# EAGLE board Word-Clock (EAGLE 7.3.0), part 1 of 2
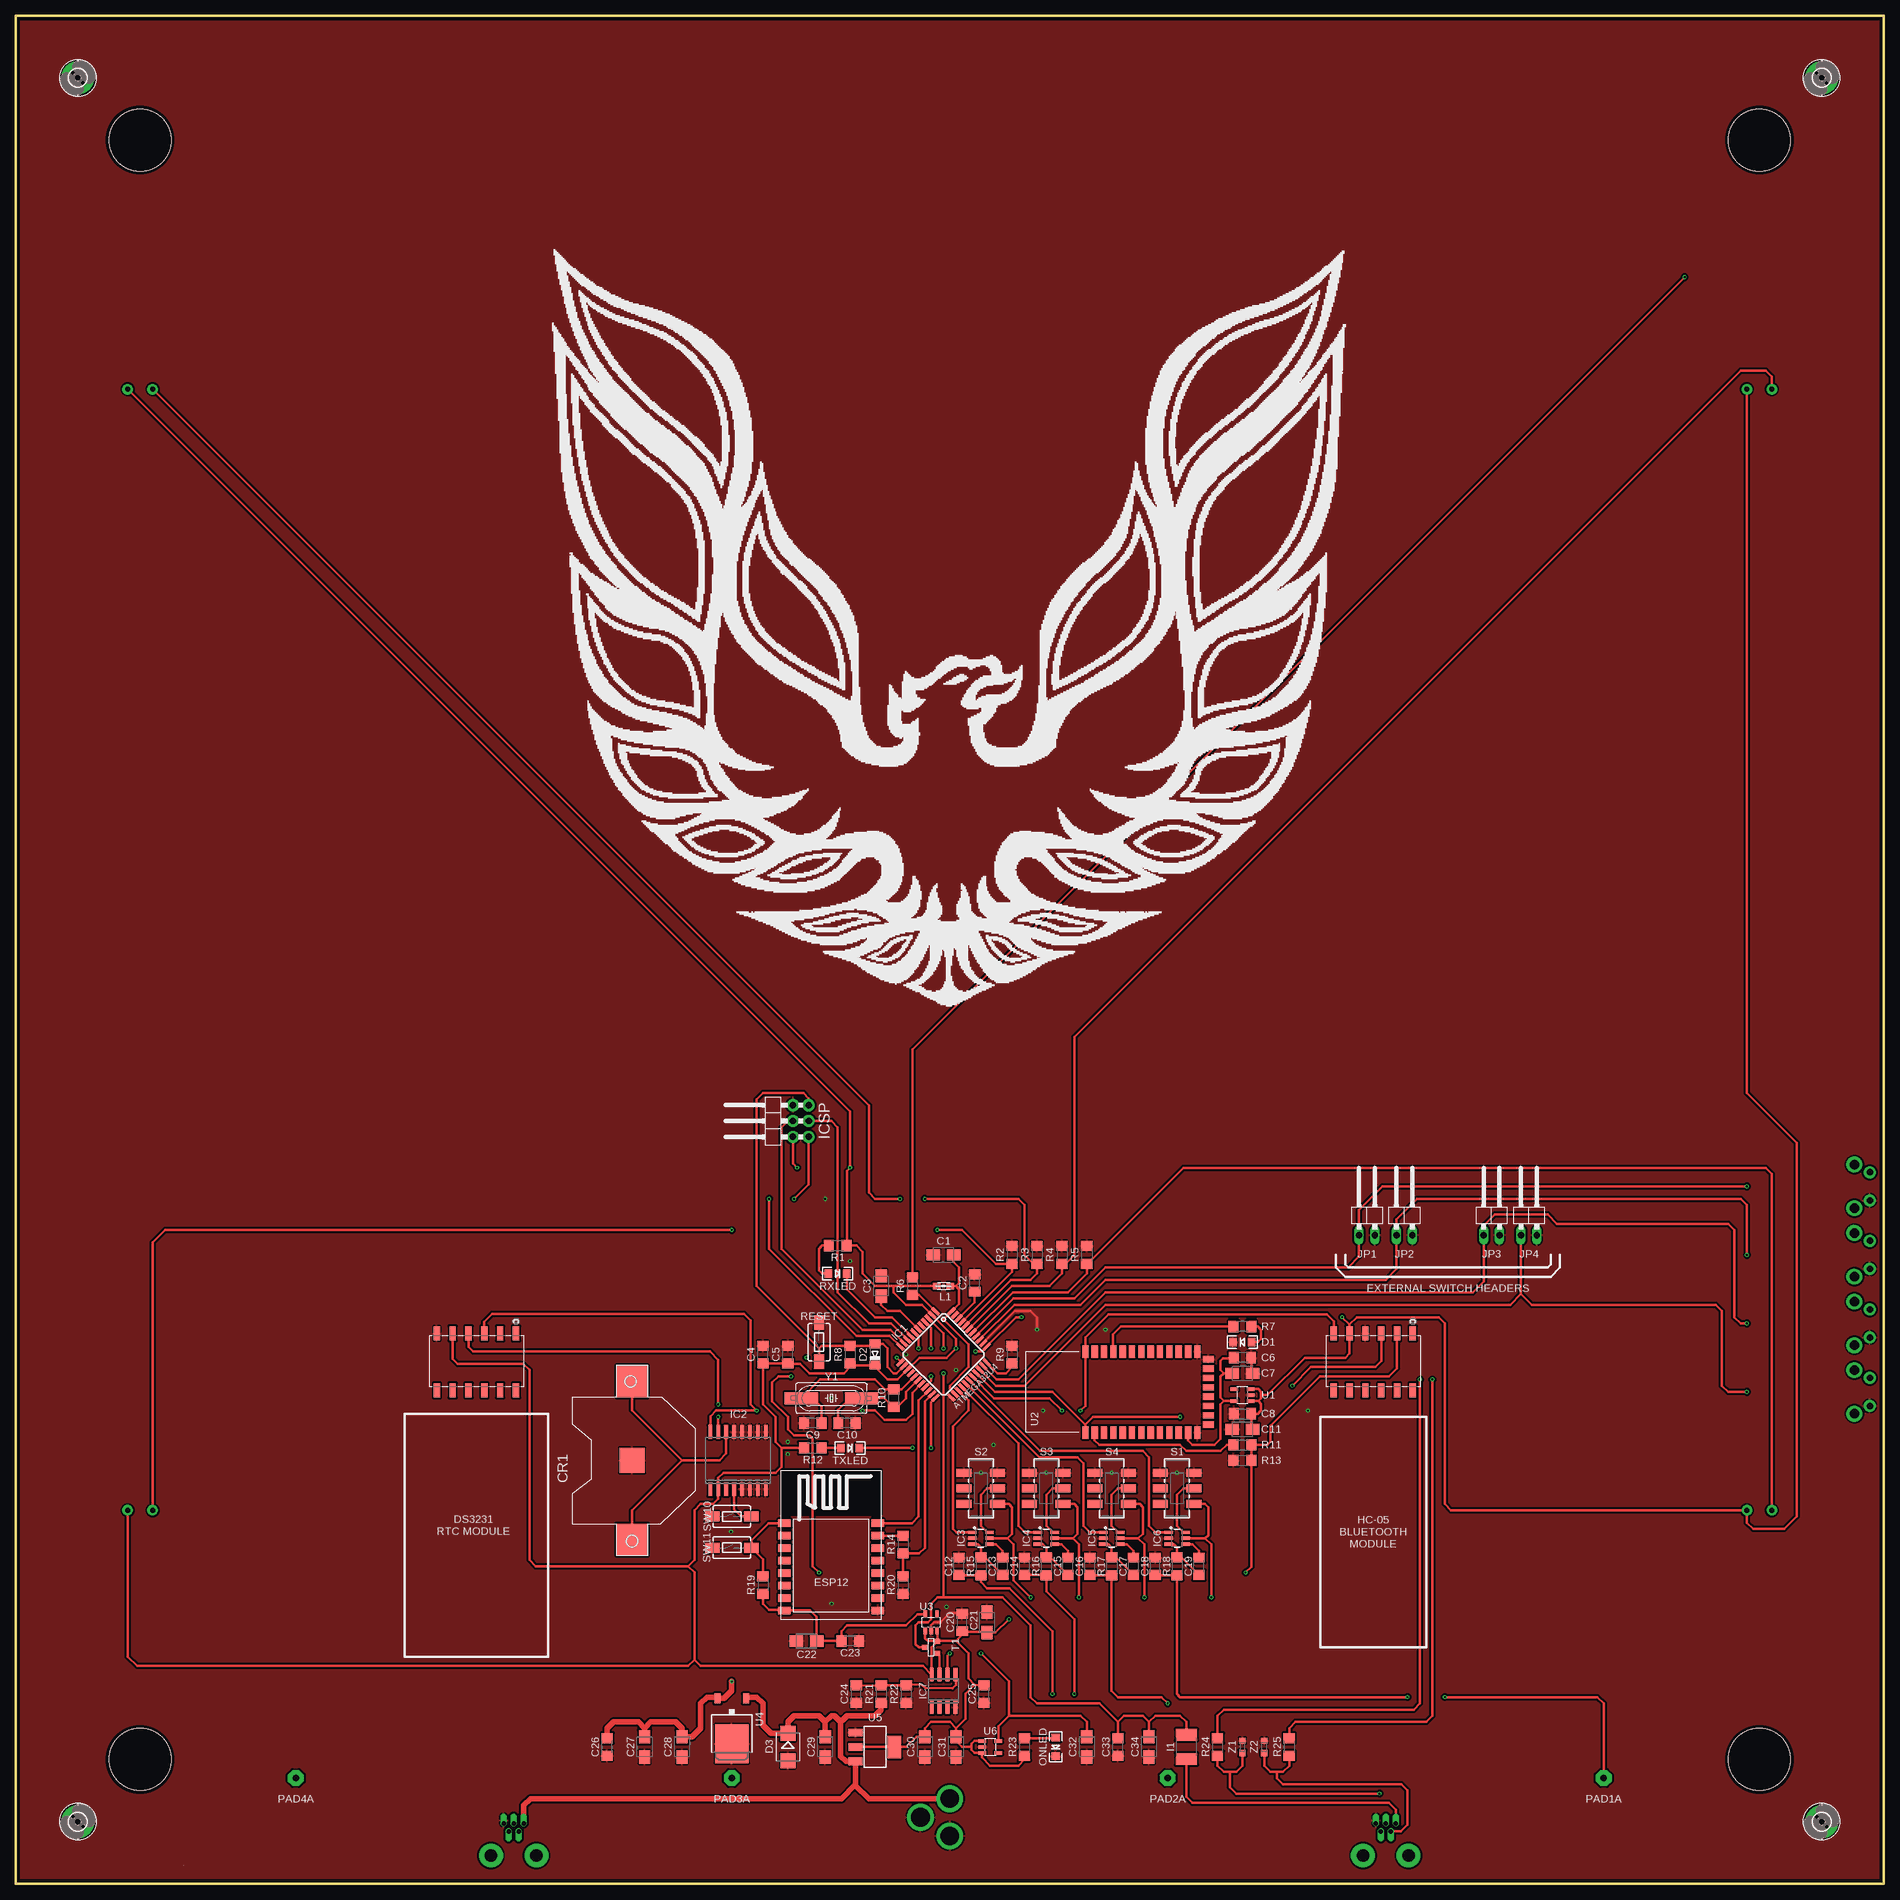
[diagram p4: board, top side]
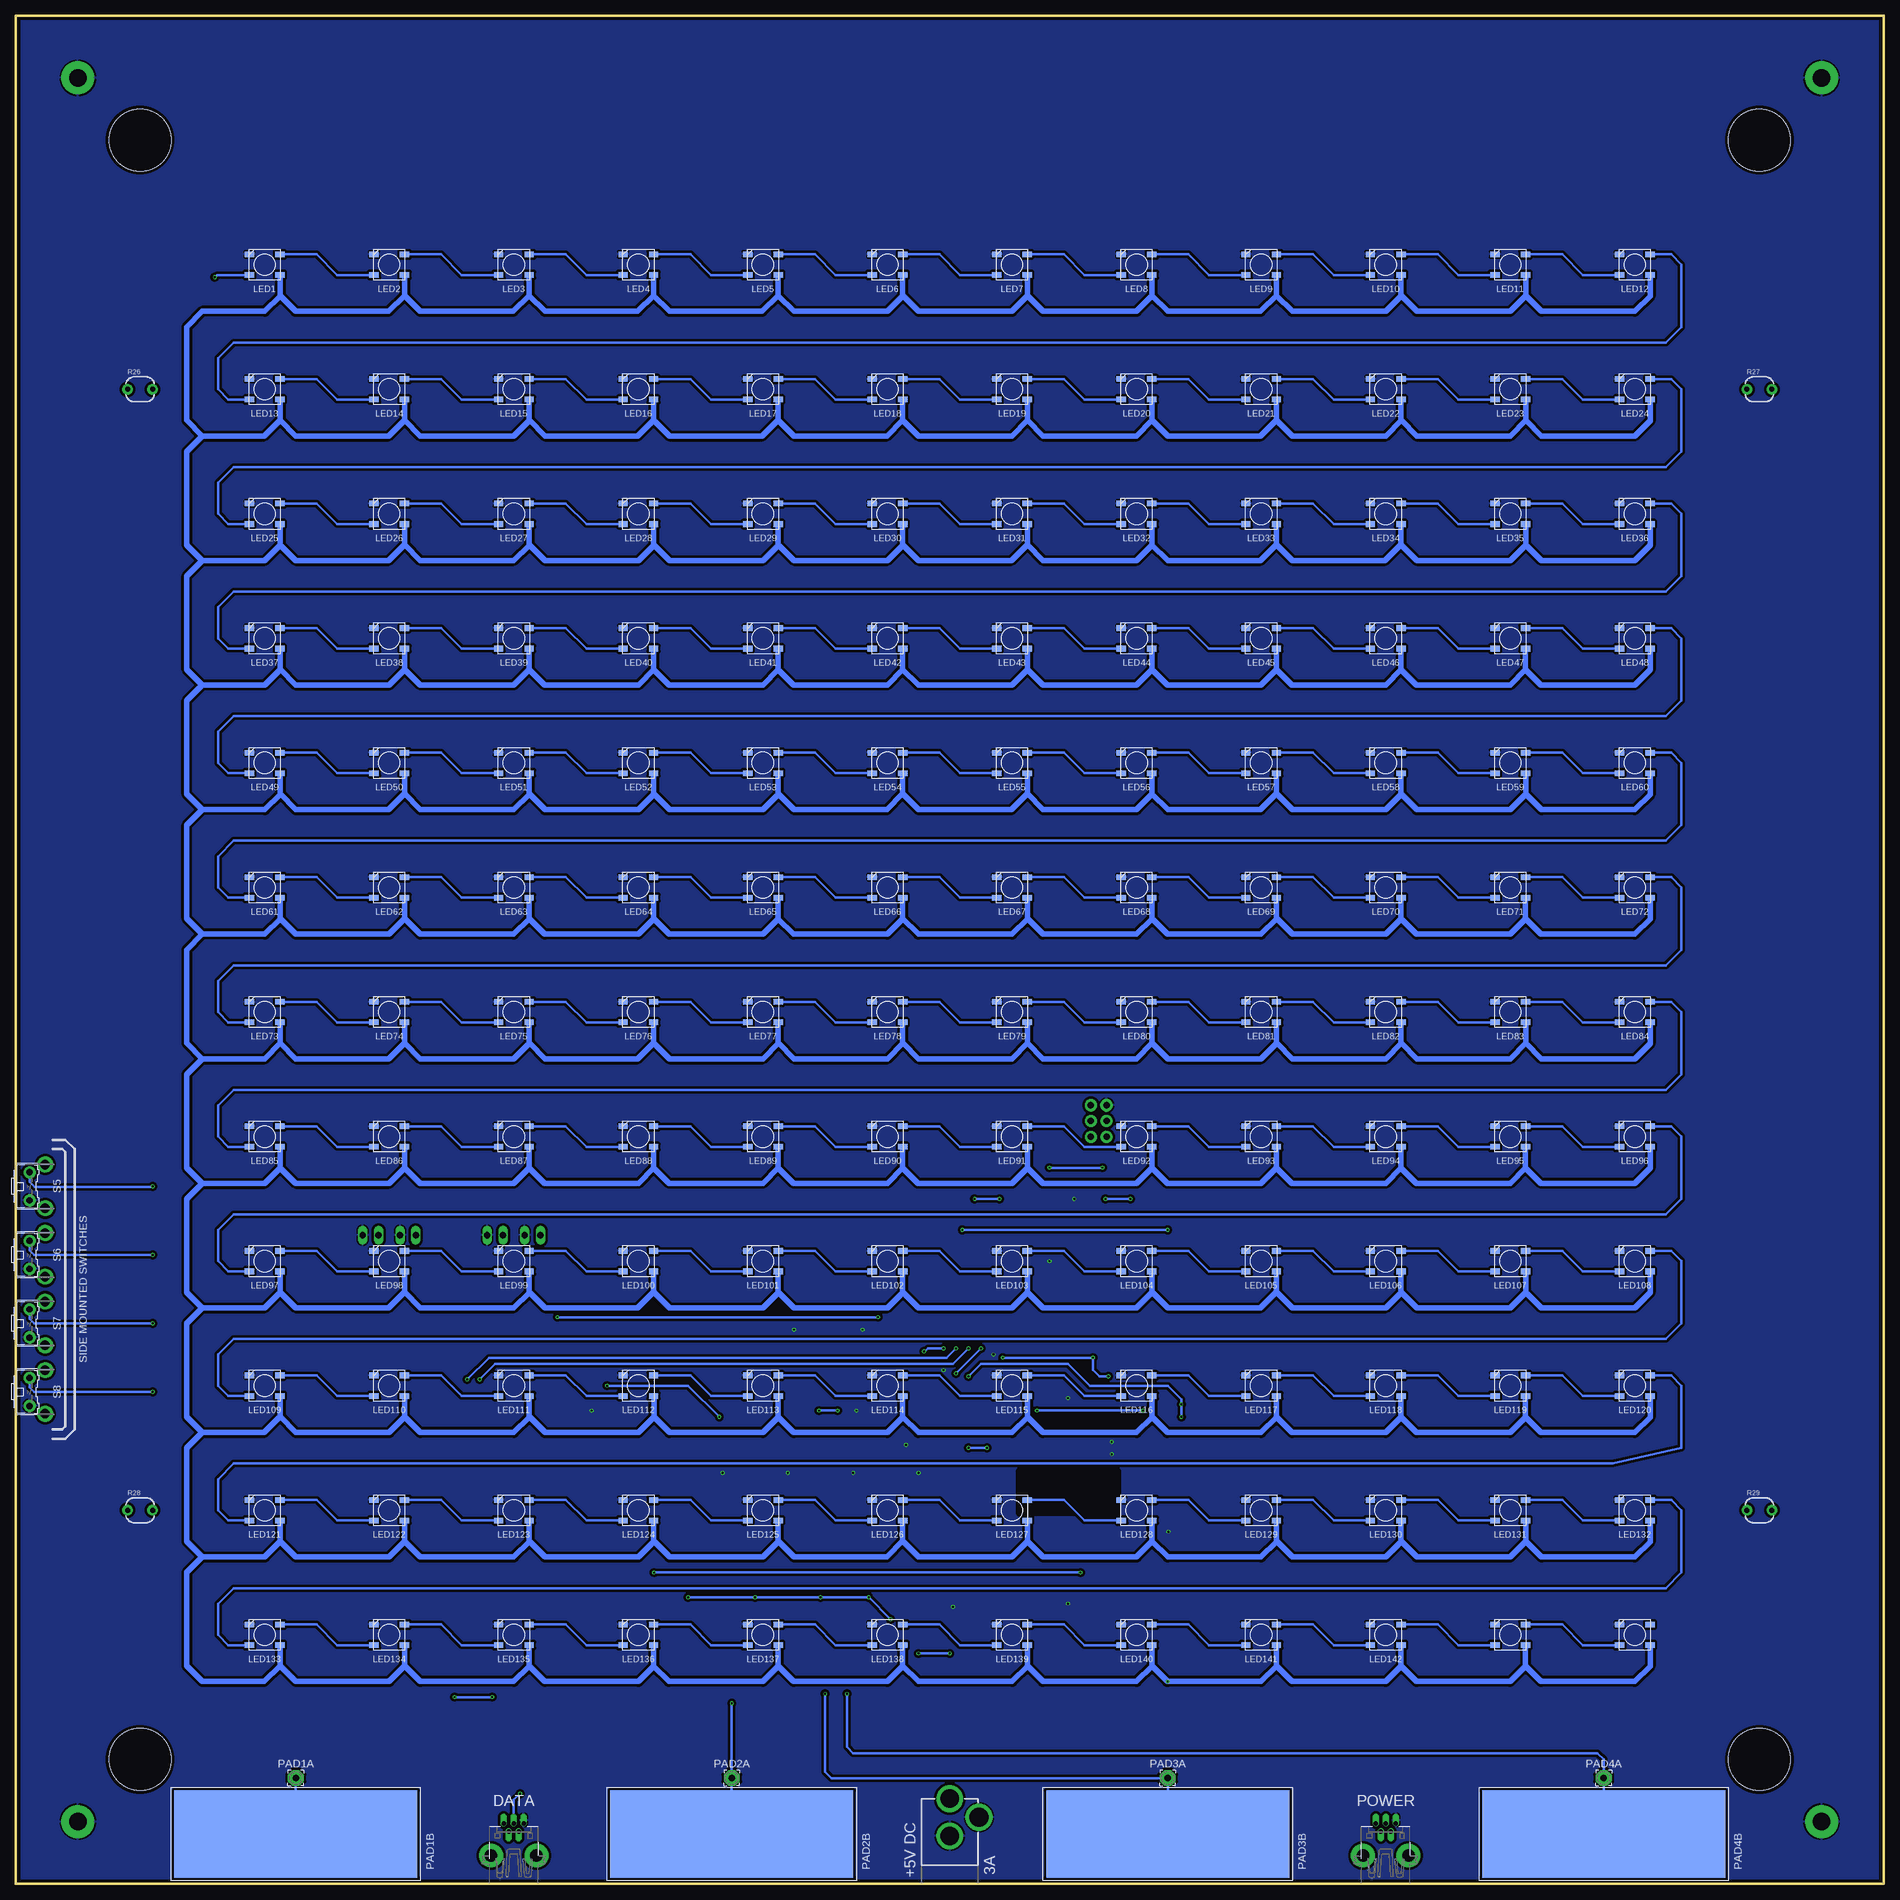
[diagram p5: board, bottom side, seen from below]

Size 300 x 300 mm. Coordinates in mm from the lower left corner, seen from the top.
Outline: 0,0 0,300 300,300 300,0 0,0
Copper layers (1*16): Top 0.035mm / dielectric 1.6mm / Bottom 0.035mm
Design rules "Elecrow_2-layer_PCB_eagle_rule": minimum track width 6mil, minimum drill 12mil, track to track 6mil, track to pad 6mil, pad to pad 6mil, via to via 8mil, smd to smd 0mil, copper to edge 20mil, drill to drill 10mil, minimum pad ring 6mil, minimum via ring 6mil, stop-mask expansion 0mil, vias tented up to drill 100mil, thermal gap 10mil
Net classes: 0 default: width 0.254 mm, drill 0.61 mm, clearance 0.254 mm; 1 power: width 0.254 mm, drill 0.61 mm, clearance 0.254 mm; 2 gnd: width 0.254 mm, drill 0.61 mm, clearance 0.254 mm; 3 usbvcc: width 0.254 mm, drill 0.61 mm, clearance 0.254 mm; 4 aref: width 0.254 mm, drill 0.61 mm, clearance 0.254 mm
Holes 10 mm at 20,280 280,280 20,20 280,20

## Footprints (pad centres in the part's own frame; a part is rotated, then mirrored left to right if it is on the bottom)
POWER_JACK_PTH = drill 2.997 pad 4.318: GND 0,7.7; GNDBREAK 4.7,10.7; PWR 0,13.7
SAMTEC_SSM-106-S-SH = smd 1.016 x 2.286: 1 0,0; 2 2.54,0; 3 5.08,0; 4 7.62,0; 5 10.16,0; 6 12.7,0; 8 12.7,9.144; 10 10.16,9.144; 12 7.62,9.144; 14 5.08,9.144; 16 2.54,9.144; 18 0,9.144
B/3528-21W = smd 2.15 x 1.8: + 1.625,0; - -1.625,0
C1206 = smd 1.6 x 1.8: 1 -1.4,0; 2 1.4,0
CR2032-SMD = smd 5.08 x 5.08: +$1 -12.7,0; +$2 12.7,0 | smd 4.064 x 4.064: - 0,0
LED-1206 = smd 1.2 x 1.4: A -1.5,0; C 1.5,0
MINIMELF = smd 1.4 x 1.8: A 1.7,0; C -1.7,0
SMB = smd 2.4 x 2.4: A 2.2,0; C -2.2,0
USB-MINIB-THM-MOLEX = drill 0.7 offset: D+ 0,9.72; D- -0.8,8.42; GND 1.6,9.72; ID 0.8,8.42; VBUS -1.6,9.72 | drill 2 pad 3.81: GND1 -3.65,4.57; GND4 3.65,4.57
ESP-12 = smd 2 x 1.2: 1 -7.5,4.5; 2 -7.5,2.5; 3 -7.5,0.5; 4 -7.5,-1.5; 5 -7.5,-3.5; 6 -7.5,-5.5; 7 -7.5,-7.5; 8 -7.5,-9.5; 9 7.5,-9.5; 10 7.5,-7.5; 11 7.5,-5.5; 12 7.5,-3.5; 13 7.5,-1.5; 14 7.5,0.5; 15 7.5,2.5; 16 7.5,4.5
2,8-PAD = drill 2.8 pad 5.334: B2,8 0,0
L1812 = smd 1.9 x 3.4: 1 -1.95,0; 2 1.95,0
TQFP44 = smd 1.5 x 0.5: 1 -5.8,4; 2 -5.8,3.2; 3 -5.8,2.4; 4 -5.8,1.6; 5 -5.8,0.8; 6 -5.8,0; 7 -5.8,-0.8; 8 -5.8,-1.6; 9 -5.8,-2.4; 10 -5.8,-3.2; 11 -5.8,-4; 23 5.8,-4; 24 5.8,-3.2; 25 5.8,-2.4; 26 5.8,-1.6; 27 5.8,-0.8; 28 5.8,0; 29 5.8,0.8; 30 5.8,1.6; 31 5.8,2.4; 32 5.8,3.2; 33 5.8,4 | smd 0.5 x 1.5: 12 -4,-5.8; 13 -3.2,-5.8; 14 -2.4,-5.8; 15 -1.6,-5.8; 16 -0.8,-5.8; 17 0,-5.8; 18 0.8,-5.8; 19 1.6,-5.8; 20 2.4,-5.8; 21 3.2,-5.8; 22 4,-5.8; 34 4,5.8; 35 3.2,5.8; 36 2.4,5.8; 37 1.6,5.8; 38 0.8,5.8; 39 0,5.8; 40 -0.8,5.8; 41 -1.6,5.8; 42 -2.4,5.8; 43 -3.2,5.8; 44 -4,5.8
SO16W = smd 0.6 x 2.2: 1 -4.445,-4.6; 2 -3.175,-4.6; 3 -1.905,-4.6; 4 -0.635,-4.6; 5 0.635,-4.6; 6 1.905,-4.6; 7 3.175,-4.6; 8 4.445,-4.6; 9 4.445,4.6; 10 3.175,4.6; 11 1.905,4.6; 12 0.635,4.6; 13 -0.635,4.6; 14 -1.905,4.6; 15 -3.175,4.6; 16 -4.445,4.6
SOT23-6 = smd 0.55 x 1.35: 1 -0.95,-1.375; 2 0,-1.375; 3 0.95,-1.375; 4 0.95,1.375; 5 0,1.375; 6 -0.95,1.375
SO08 = smd 0.6 x 2.2: 1 -1.905,-2.6; 2 -0.635,-2.6; 3 0.635,-2.6; 4 1.905,-2.6; 5 1.905,2.6; 6 0.635,2.6; 7 -0.635,2.6; 8 -1.905,2.6
2X03/90 = drill 1.016 pad 1.93: 1 -2.54,-6.35; 2 -2.54,-3.81; 3 0,-6.35; 4 0,-3.81; 5 2.54,-6.35; 6 2.54,-3.81
1X02/90 = drill 1.016 long: 1 -1.27,-3.81; 2 1.27,-3.81
0805 = smd 1.2 x 1: 1 -1.1,0; 2 1.1,0
WS2812B = smd 1.5 x 0.9: 1-VDD 2.45,-1.65; 2-DOUT 2.45,1.65; 3-GND -2.45,1.65; 4-DIN -2.45,-1.65
2,54/1,0 = drill 1.016 pad 2.54 octagon: 1 0,0
CAPSENSE_PAD = smd 39 x 14: P$1 0,0
R1206 = smd 1.6 x 1.803: 1 -1.422,0; 2 1.422,0
PHOTOCELL = drill 0.8 pad 1.676: 1 -2,0; 2 2,0
TACTILE-SWITCH-1101NE = smd 2.3 x 1.6: 1 -3.15,0; 2 3.15,0
JS202011SCQN = smd 1.27 x 2.4: 1 -2.5,-2.7; 2 0,-2.7; 3 2.5,-2.7; 4 -2.5,2.7; 5 0,2.7; 6 2.5,2.7
B3F-31XX = drill 1.016 pad 1.93: 1 -2.261,-1.245; 2 2.261,-1.245 | drill 1.499 pad 2.54: 3 -3.505,1.245; 4 3.505,1.245
SOT-23 = smd 0.787 x 0.889: 1 0.025,-1.016; 2 -0.94,1.016; 3 0.991,1.016
SOT23-DBV = smd 0.55 x 1.2: 1 -0.95,-1.3; 2 0,-1.3; 3 0.95,-1.3; 4 0.95,1.3; 5 -0.95,1.3
BLUETOOTH_SMD = smd 2 x 1: 1 0,0; 2 0,-1.5; 3 0,-3; 4 0,-4.5; 5 0,-6; 6 0,-7.5; 7 0,-9; 8 0,-10.5; 9 0,-12; 10 0,-13.5; 11 0,-15; 12 0,-16.5; 13 0,-18; 22 13,-18; 23 13,-16.5; 24 13,-15; 25 13,-13.5; 26 13,-12; 27 13,-10.5; 28 13,-9; 29 13,-7.5; 30 13,-6; 31 13,-4.5; 32 13,-3; 33 13,-1.5; 34 13,0 | smd 1 x 1.8: 14 1.25,-19.75; 15 2.75,-19.75; 16 4.25,-19.75; 17 5.75,-19.75; 18 7.25,-19.75; 19 8.75,-19.75; 20 10.25,-19.75; 21 11.75,-19.75
TO-252 = smd 1 x 1.6: 1 -2.28,-4.8; 2 2.28,-4.8 | smd 5.4 x 6.2: 3 0,2.5
SOT223 = smd 1.219 x 2.235: 1 -2.311,-3.099; 2 0,-3.099; 3 2.311,-3.099 | smd 3.6 x 2.2: 4 0,3.099
HC49UP = smd 5.334 x 1.93: 1 -4.826,0; 2 4.826,0
CT/CN0603 = smd 1 x 1: 1 -1,0; 2 1,0

## Placement (x,y rotation side)
+5VDC  POWER_JACKPTH  [POWER_JACK_PTH]  150,0 0 bottom
BLUETOOTH  SSM-106-S-SH  [SAMTEC_SSM-106-S-SH]  224.35,88.4 180 top
C1  1uF  [B/3528-21W]  149,101 0 top
C2  100n  [C1206]  154,96.5 90 top
C3  1uF  [B/3528-21W]  139,96 270 top
C4  100n  [C1206]  120,85 90 top
C5  100n  [C1206]  124,85 90 top
C6  100n  [C1206]  197,84.5 180 top
C7  1u  [B/3528-21W]  197,82 180 top
C8  100n  [C1206]  197,75.5 0 top
C9  22p  [C1206]  128,74 180 top
C10  22p  [C1206]  133.5,74 180 top
C11  1u  [B/3528-21W]  197,73 0 top
C12  100n  [C1206]  151.5,51 90 top
C13  100n  [C1206]  158.5,51 90 top
C14  100n  [C1206]  162,51 90 top
C15  100n  [C1206]  169,51 90 top
C16  100n  [C1206]  172.5,51 90 top
C17  100n  [C1206]  179.5,51 90 top
C18  100n  [C1206]  183,51 90 top
C19  100n  [C1206]  190,51 90 top
C20  100n  [C1206]  152,42 90 top
C21  1u  [B/3528-21W]  156,42 270 top
C22  1u  [B/3528-21W]  127,39 0 top
C23  100n  [C1206]  134,39 180 top
C24  100n  [C1206]  135,30.5 90 top
C25  100n  [C1206]  155.5,30.5 90 top
C26  100n  [C1206]  95,22 90 top
C27  10u  [B/3528-21W]  101,22 90 top
C28  10u  [B/3528-21W]  107,22 90 top
C29  10u  [B/3528-21W]  130,22 90 top
C30  10u  [B/3528-21W]  146,22 90 top
C31  1u  [B/3528-21W]  151,22 90 top
C32  1u  [B/3528-21W]  172,22 90 top
C33  100n  [C1206]  177,22 90 top
C34  10u  [B/3528-21W]  182,22 90 top
CR1  CR2032  [CR2032-SMD]  99,68 90 top
D1  BLUE  [LED-1206]  197,87 180 top
D2  CD1206-S01575  [MINIMELF]  138,85 90 top
D3  M7  [SMB]  124,22 270 top
DATA  USBDATA  [USB-MINIB-THM-MOLEX]  220,0 0 bottom
DS3231  SSM-106-S-SH  [SAMTEC_SSM-106-S-SH]  80.35,88.4 180 top
ESP12  ESP12  [ESP-12]  130.94,53.41 0 top
H1  [2,8-PAD]  10,10 0 top
H2  [2,8-PAD]  10,290 0 top
H3  [2,8-PAD]  290,290 0 top
H4  [2,8-PAD]  290,10 0 top
I1  MF-MSMF050-2 500mA  [L1812]  188,22 90 top
IC1  ATMEGA32U4TQFP-44  [TQFP44]  149,85 315 top
IC2  DS3231/SO  [SO16W]  116,68 0 top
IC3  AT42QT1010SOT23  [SOT23-6]  155,55.5 270 top
IC4  AT42QT1010SOT23  [SOT23-6]  165.5,55.5 270 top
IC5  AT42QT1010SOT23  [SOT23-6]  176,55.5 270 top
IC6  AT42QT1010SOT23  [SOT23-6]  186.5,55.5 270 top
IC7  LMV358IDGKR  [SO08]  149,31 0 top
ICSP  ICSP  [2X03/90]  121,122.5 90 top
JP1  [1X02/90]  217,108 0 top
JP2  [1X02/90]  223,108 0 top
JP3  [1X02/90]  237,108 0 top
JP4  [1X02/90]  243,108 0 top
L1  MH2029-300Y  [0805]  149,96 0 top
LED1  WS2812B  [WS2812B]  260,260 0 bottom
LED2  WS2812B  [WS2812B]  240,260 0 bottom
LED3  WS2812B  [WS2812B]  220,260 0 bottom
LED4  WS2812B  [WS2812B]  200,260 0 bottom
LED5  WS2812B  [WS2812B]  180,260 0 bottom
LED6  WS2812B  [WS2812B]  160,260 0 bottom
LED7  WS2812B  [WS2812B]  140,260 0 bottom
LED8  WS2812B  [WS2812B]  120,260 0 bottom
LED9  WS2812B  [WS2812B]  100,260 0 bottom
LED10  WS2812B  [WS2812B]  80,260 0 bottom
LED11  WS2812B  [WS2812B]  60,260 0 bottom
LED12  WS2812B  [WS2812B]  40,260 0 bottom
LED13  WS2812B  [WS2812B]  260,240 0 bottom
LED14  WS2812B  [WS2812B]  240,240 0 bottom
LED15  WS2812B  [WS2812B]  220,240 0 bottom
LED16  WS2812B  [WS2812B]  200,240 0 bottom
LED17  WS2812B  [WS2812B]  180,240 0 bottom
LED18  WS2812B  [WS2812B]  160,240 0 bottom
LED19  WS2812B  [WS2812B]  140,240 0 bottom
LED20  WS2812B  [WS2812B]  120,240 0 bottom
LED21  WS2812B  [WS2812B]  100,240 0 bottom
LED22  WS2812B  [WS2812B]  80,240 0 bottom
LED23  WS2812B  [WS2812B]  60,240 0 bottom
LED24  WS2812B  [WS2812B]  40,240 0 bottom
LED25  WS2812B  [WS2812B]  260,220 0 bottom
LED26  WS2812B  [WS2812B]  240,220 0 bottom
LED27  WS2812B  [WS2812B]  220,220 0 bottom
LED28  WS2812B  [WS2812B]  200,220 0 bottom
LED29  WS2812B  [WS2812B]  180,220 0 bottom
LED30  WS2812B  [WS2812B]  160,220 0 bottom
LED31  WS2812B  [WS2812B]  140,220 0 bottom
LED32  WS2812B  [WS2812B]  120,220 0 bottom
LED33  WS2812B  [WS2812B]  100,220 0 bottom
LED34  WS2812B  [WS2812B]  80,220 0 bottom
LED35  WS2812B  [WS2812B]  60,220 0 bottom
LED36  WS2812B  [WS2812B]  40,220 0 bottom
LED37  WS2812B  [WS2812B]  260,200 0 bottom
LED38  WS2812B  [WS2812B]  240,200 0 bottom
LED39  WS2812B  [WS2812B]  220,200 0 bottom
LED40  WS2812B  [WS2812B]  200,200 0 bottom
LED41  WS2812B  [WS2812B]  180,200 0 bottom
LED42  WS2812B  [WS2812B]  160,200 0 bottom
LED43  WS2812B  [WS2812B]  140,200 0 bottom
LED44  WS2812B  [WS2812B]  120,200 0 bottom
LED45  WS2812B  [WS2812B]  100,200 0 bottom
LED46  WS2812B  [WS2812B]  80,200 0 bottom
LED47  WS2812B  [WS2812B]  60,200 0 bottom
LED48  WS2812B  [WS2812B]  40,200 0 bottom
LED49  WS2812B  [WS2812B]  260,180 0 bottom
LED50  WS2812B  [WS2812B]  240,180 0 bottom
LED51  WS2812B  [WS2812B]  220,180 0 bottom
LED52  WS2812B  [WS2812B]  200,180 0 bottom
LED53  WS2812B  [WS2812B]  180,180 0 bottom
LED54  WS2812B  [WS2812B]  160,180 0 bottom
LED55  WS2812B  [WS2812B]  140,180 0 bottom
LED56  WS2812B  [WS2812B]  120,180 0 bottom
LED57  WS2812B  [WS2812B]  100,180 0 bottom
LED58  WS2812B  [WS2812B]  80,180 0 bottom
LED59  WS2812B  [WS2812B]  60,180 0 bottom
LED60  WS2812B  [WS2812B]  40,180 0 bottom
LED61  WS2812B  [WS2812B]  260,160 0 bottom
LED62  WS2812B  [WS2812B]  240,160 0 bottom
LED63  WS2812B  [WS2812B]  220,160 0 bottom
LED64  WS2812B  [WS2812B]  200,160 0 bottom
LED65  WS2812B  [WS2812B]  180,160 0 bottom
LED66  WS2812B  [WS2812B]  160,160 0 bottom
LED67  WS2812B  [WS2812B]  140,160 0 bottom
LED68  WS2812B  [WS2812B]  120,160 0 bottom
LED69  WS2812B  [WS2812B]  100,160 0 bottom
LED70  WS2812B  [WS2812B]  80,160 0 bottom
LED71  WS2812B  [WS2812B]  60,160 0 bottom
LED72  WS2812B  [WS2812B]  40,160 0 bottom
LED73  WS2812B  [WS2812B]  260,140 0 bottom
LED74  WS2812B  [WS2812B]  240,140 0 bottom
LED75  WS2812B  [WS2812B]  220,140 0 bottom
LED76  WS2812B  [WS2812B]  200,140 0 bottom
LED77  WS2812B  [WS2812B]  180,140 0 bottom
LED78  WS2812B  [WS2812B]  160,140 0 bottom
LED79  WS2812B  [WS2812B]  140,140 0 bottom
LED80  WS2812B  [WS2812B]  120,140 0 bottom
LED81  WS2812B  [WS2812B]  100,140 0 bottom
LED82  WS2812B  [WS2812B]  80,140 0 bottom
LED83  WS2812B  [WS2812B]  60,140 0 bottom
LED84  WS2812B  [WS2812B]  40,140 0 bottom
LED85  WS2812B  [WS2812B]  260,120 0 bottom
LED86  WS2812B  [WS2812B]  240,120 0 bottom
LED87  WS2812B  [WS2812B]  220,120 0 bottom
LED88  WS2812B  [WS2812B]  200,120 0 bottom
LED89  WS2812B  [WS2812B]  180,120 0 bottom
LED90  WS2812B  [WS2812B]  160,120 0 bottom
LED91  WS2812B  [WS2812B]  140,120 0 bottom
LED92  WS2812B  [WS2812B]  120,120 0 bottom
LED93  WS2812B  [WS2812B]  100,120 0 bottom
LED94  WS2812B  [WS2812B]  80,120 0 bottom
LED95  WS2812B  [WS2812B]  60,120 0 bottom
LED96  WS2812B  [WS2812B]  40,120 0 bottom
LED97  WS2812B  [WS2812B]  260,100 0 bottom
LED98  WS2812B  [WS2812B]  240,100 0 bottom
LED99  WS2812B  [WS2812B]  220,100 0 bottom
LED100  WS2812B  [WS2812B]  200,100 0 bottom
LED101  WS2812B  [WS2812B]  180,100 0 bottom
LED102  WS2812B  [WS2812B]  160,100 0 bottom
LED103  WS2812B  [WS2812B]  140,100 0 bottom
LED104  WS2812B  [WS2812B]  120,100 0 bottom
LED105  WS2812B  [WS2812B]  100,100 0 bottom
LED106  WS2812B  [WS2812B]  80,100 0 bottom
LED107  WS2812B  [WS2812B]  60,100 0 bottom
LED108  WS2812B  [WS2812B]  40,100 0 bottom
LED109  WS2812B  [WS2812B]  260,80 0 bottom
LED110  WS2812B  [WS2812B]  240,80 0 bottom
LED111  WS2812B  [WS2812B]  220,80 0 bottom
LED112  WS2812B  [WS2812B]  200,80 0 bottom
LED113  WS2812B  [WS2812B]  180,80 0 bottom
LED114  WS2812B  [WS2812B]  160,80 0 bottom
LED115  WS2812B  [WS2812B]  140,80 0 bottom
LED116  WS2812B  [WS2812B]  120,80 0 bottom
LED117  WS2812B  [WS2812B]  100,80 0 bottom
LED118  WS2812B  [WS2812B]  80,80 0 bottom
LED119  WS2812B  [WS2812B]  60,80 0 bottom
LED120  WS2812B  [WS2812B]  40,80 0 bottom
LED121  WS2812B  [WS2812B]  260,60 0 bottom
LED122  WS2812B  [WS2812B]  240,60 0 bottom
LED123  WS2812B  [WS2812B]  220,60 0 bottom
LED124  WS2812B  [WS2812B]  200,60 0 bottom
LED125  WS2812B  [WS2812B]  180,60 0 bottom
LED126  WS2812B  [WS2812B]  160,60 0 bottom
LED127  WS2812B  [WS2812B]  140,60 0 bottom
LED128  WS2812B  [WS2812B]  120,60 0 bottom
LED129  WS2812B  [WS2812B]  100,60 0 bottom
LED130  WS2812B  [WS2812B]  80,60 0 bottom
LED131  WS2812B  [WS2812B]  60,60 0 bottom
LED132  WS2812B  [WS2812B]  40,60 0 bottom
LED133  WS2812B  [WS2812B]  260,40 0 bottom
LED134  WS2812B  [WS2812B]  240,40 0 bottom
LED135  WS2812B  [WS2812B]  220,40 0 bottom
LED136  WS2812B  [WS2812B]  200,40 0 bottom
LED137  WS2812B  [WS2812B]  180,40 0 bottom
LED138  WS2812B  [WS2812B]  160,40 0 bottom
LED139  WS2812B  [WS2812B]  140,40 0 bottom
LED140  WS2812B  [WS2812B]  120,40 0 bottom
LED141  WS2812B  [WS2812B]  100,40 0 bottom
LED142  WS2812B  [WS2812B]  80,40 0 bottom
LED143  WS2812B  [WS2812B]  60,40 0 bottom
LED144  WS2812B  [WS2812B]  40,40 0 bottom
ONLED  BLUE  [LED-1206]  167,22 270 top
PAD1A  PAD1A  [2,54/1,0]  255,17 180 bottom
PAD1B  CAPSENSE_PAD  [CAPSENSE_PAD]  255,8 0 bottom
PAD2A  PAD2A  [2,54/1,0]  185,17 180 bottom
PAD2B  CAPSENSE_PAD  [CAPSENSE_PAD]  185,8 0 bottom
PAD3A  PAD3A  [2,54/1,0]  115,17 180 bottom
PAD3B  CAPSENSE_PAD  [CAPSENSE_PAD]  115,8 0 bottom
PAD4A  PAD4A  [2,54/1,0]  45,17 180 bottom
PAD4B  CAPSENSE_PAD  [CAPSENSE_PAD]  45,8 0 bottom
POWER  USBPOWER  [USB-MINIB-THM-MOLEX]  80,0 0 bottom
R1  1K  [R1206]  132,102.5 180 top
R2  12K  [R1206]  160,101 90 top
R3  12K  [R1206]  164,101 90 top
R4  12K  [R1206]  168,101 90 top
R5  12K  [R1206]  172,101 90 top
R6  470  [R1206]  144,96 90 top
R7  470  [R1206]  197,89.5 0 top
R8  10K  [R1206]  134,85 90 top
R9  10K  [R1206]  160,85 90 top
R10  1M  [R1206]  141,78 90 top
R11  12K  [R1206]  197,70.5 180 top
R12  1K  [R1206]  128,70 180 top
R13  22K  [R1206]  197,68 180 top
R14  12K  [R1206]  142.5,54.5 90 top
R15  12K  [R1206]  155,51 90 top
R16  12K  [R1206]  165.5,51 90 top
R17  12K  [R1206]  176,51 90 top
R18  12K  [R1206]  186.5,51 90 top
R19  22K  [R1206]  120,48 90 top
R20  22K  [R1206]  142.5,48 90 top
R21  10K  [R1206]  139,30.5 90 top
R22  10K  [R1206]  143,30.5 90 top
R23  K  [R1206]  162,22 90 top
R24  22R  [R1206]  193,22 90 top
R25  22R  [R1206]  204.5,22 90 top
R26  PHOTOCELLPTH  [PHOTOCELL]  280,240 0 bottom
R27  PHOTOCELLPTH  [PHOTOCELL]  20,240 0 bottom
R28  PHOTOCELLPTH  [PHOTOCELL]  280,60 0 bottom
R29  PHOTOCELLPTH  [PHOTOCELL]  20,60 0 bottom
RESET  SWITCH-MOMENTARY-2SMD-1101NE  [TACTILE-SWITCH-1101NE]  129,87 90 top
RXLED  GREEN  [LED-1206]  132,98 0 top
S1  JS202011SCQN  [JS202011SCQN]  186.5,63.5 270 top
S2  JS202011SCQN  [JS202011SCQN]  155,63.5 270 top
S3  JS202011SCQN  [JS202011SCQN]  165.5,63.5 270 top
S4  JS202011SCQN  [JS202011SCQN]  176,63.5 270 top
S5  [B3F-31XX]  296.5,112 270 bottom
S6  [B3F-31XX]  296.5,101 270 bottom
S7  [B3F-31XX]  296.5,90 270 bottom
S8  [B3F-31XX]  296.5,79 270 bottom
SW10  SWITCH-MOMENTARY-2SMD-1101NE  [TACTILE-SWITCH-1101NE]  115,59 0 top
SW11  SWITCH-MOMENTARY-2SMD-1101NE  [TACTILE-SWITCH-1101NE]  115,54 0 top
T1  FDN340P  [SOT-23]  147,38 270 top
TXLED  RED  [LED-1206]  134,70 0 top
U1  LP2985-33DBVR  [SOT23-DBV]  197,78.5 90 top
U2  HC_05  [BLUETOOTH_SMD]  171.77,72.5 90 top
U3  LP2985-33DBVR  [SOT23-DBV]  147,42 0 top
U4  +12v  [TO-252]  115,25 180 top
U5  NCP1117ST50T3G  [SOT223]  138,22 270 top
U6  LP2985-33DBVR  [SOT23-DBV]  156.5,22 270 top
U$1  [FIREBIRD2]  86.28,140.99 0 top
Y1  16MHz  [HC49UP]  131,78 0 top
Z1  CG0603MLC-05E  [CT/CN0603]  197,22 90 top
Z2  CG0603MLC-05E  [CT/CN0603]  200.5,22 90 top